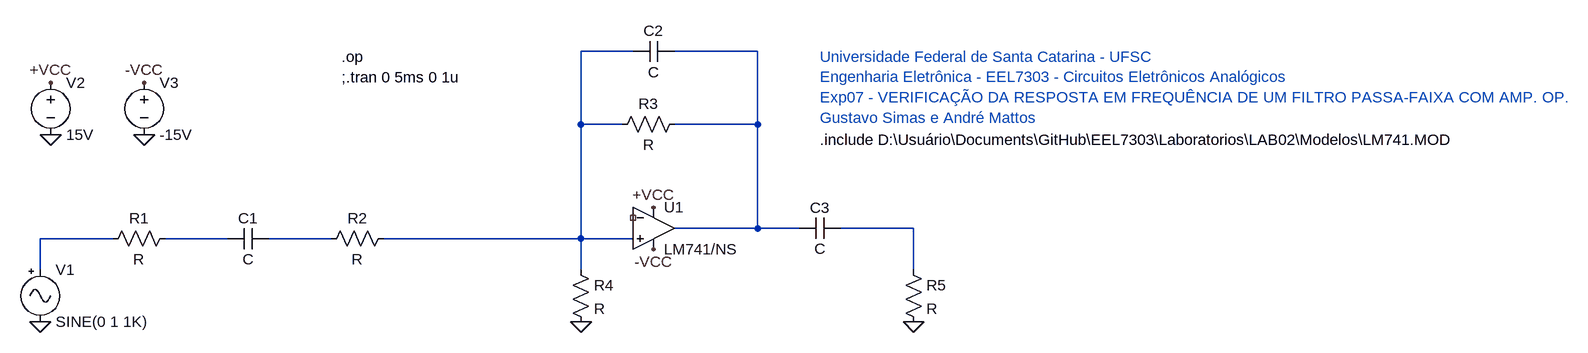
[diagram p0: schematic Draft1.asc]
Draft1.asc, the LTspice schematic file:
Version 4
SHEET 1 2440 680
WIRE 1008 -240 928 -240
WIRE 1200 -240 1072 -240
WIRE 928 -128 928 -240
WIRE 992 -128 928 -128
WIRE 1200 -128 1200 -240
WIRE 1200 -128 1072 -128
WIRE 1200 32 1200 -128
WIRE 1200 32 1072 32
WIRE 1264 32 1200 32
WIRE 1440 32 1328 32
WIRE 208 48 96 48
WIRE 384 48 288 48
WIRE 544 48 448 48
WIRE 928 48 928 -128
WIRE 928 48 624 48
WIRE 1008 48 928 48
WIRE 96 96 96 48
WIRE 928 96 928 48
WIRE 1440 96 1440 32
FLAG 96 176 0
FLAG 928 176 0
FLAG 1440 176 0
FLAG 112 -112 0
FLAG 256 -112 0
FLAG 112 -192 +VCC
FLAG 256 -192 -VCC
FLAG 1040 0 +VCC
FLAG 1040 64 -VCC
SYMBOL Misc\\signal 96 80 R0
SYMATTR InstName V1
SYMBOL res 304 32 R90
WINDOW 0 0 56 VBottom 2
WINDOW 3 32 56 VTop 2
SYMATTR InstName R1
SYMBOL cap 448 32 R90
WINDOW 0 0 32 VBottom 2
WINDOW 3 32 32 VTop 2
SYMATTR InstName C1
SYMBOL res 640 32 R90
WINDOW 0 0 56 VBottom 2
WINDOW 3 32 56 VTop 2
SYMATTR InstName R2
SYMBOL res 1088 -144 R90
WINDOW 0 0 56 VBottom 2
WINDOW 3 32 56 VTop 2
SYMATTR InstName R3
SYMBOL cap 1072 -256 R90
WINDOW 0 0 32 VBottom 2
WINDOW 3 32 32 VTop 2
SYMATTR InstName C2
SYMBOL cap 1328 16 R90
WINDOW 0 0 32 VBottom 2
WINDOW 3 32 32 VTop 2
SYMATTR InstName C3
SYMBOL res 912 80 R0
SYMATTR InstName R4
SYMBOL Opamps\\opamp2 1040 -32 R0
SYMATTR InstName U1
SYMATTR Value LM741/NS
SYMBOL res 1424 80 R0
SYMATTR InstName R5
SYMBOL voltage 112 -208 R0
WINDOW 123 0 0 Left 0
WINDOW 39 0 0 Left 0
SYMATTR InstName V2
SYMATTR Value 15V
SYMBOL voltage 256 -208 R0
WINDOW 123 0 0 Left 0
WINDOW 39 0 0 Left 0
SYMATTR InstName V3
SYMATTR Value -15V
TEXT 560 -232 Left 2 !.op
TEXT 560 -200 Left 2 !;.tran 0 5ms 0 1u
TEXT 1296 -232 Left 2 ;Universidade Federal de Santa Catarina - UFSC\nEngenharia Eletrônica - EEL7303 - Circuitos Eletrônicos Analógicos\nExp07 - VERIFICAÇÃO DA RESPOSTA EM FREQUÊNCIA DE UM FILTRO PASSA-FAIXA COM AMP. OP.\nGustavo Simas e André Mattos
TEXT 1296 -104 Left 2 !.include D:\\Usuário\\Documents\\GitHub\\EEL7303\\Laboratorios\\LAB02\\Modelos\\LM741.MOD

The netlist it stands for:
* Draft1.asc
V1 N004 0 SINE(0 1 1K)
R1 N005 N004 R
C1 N006 N005 C
R2 N001 N006 R
R3 N002 N001 R
C2 N002 N001 C
C3 N003 N002 C
R4 N001 0 R
XU1 N001 NC_01 +VCC -VCC N002 LM741/NS  ; pins In+ In- V+ V- OUT
R5 N003 0 R
V2 +VCC 0 15V
V3 -VCC 0 -15V
.op
;.tran 0 5ms 0 1u
* Universidade Federal de Santa Catarina - UFSC
* Engenharia Eletrônica - EEL7303 - Circuitos Eletrônicos Analógicos
* Exp07 - VERIFICAÇÃO DA RESPOSTA EM FREQUÊNCIA DE UM FILTRO PASSA-FAIXA COM AMP. OP.
* Gustavo Simas e André Mattos
.include D:\Usuário\Documents\GitHub\EEL7303\Laboratorios\LAB02\Modelos\LM741.MOD
.backanno
.end